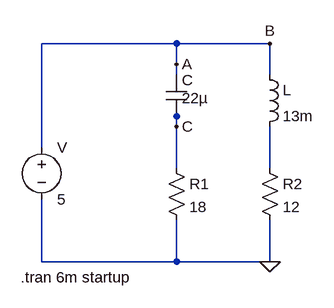
[diagram p0: schematic Carga.asc]
Carga.asc, the LTspice schematic file:
Version 4
SHEET 1 880 680
WIRE 272 0 64 0
WIRE 416 0 272 0
WIRE 272 32 272 0
WIRE 272 48 272 32
WIRE 416 48 416 0
WIRE 272 112 272 96
WIRE 272 128 272 112
WIRE 64 160 64 0
WIRE 272 192 272 128
WIRE 416 192 416 128
WIRE 64 336 64 240
WIRE 272 336 272 272
WIRE 272 336 64 336
WIRE 416 336 416 272
WIRE 416 336 272 336
FLAG 416 336 0
FLAG 416 0 B
FLAG 272 128 C
FLAG 272 32 A
SYMBOL voltage 64 144 R0
WINDOW 123 0 0 Left 0
WINDOW 39 0 0 Left 0
SYMATTR InstName V
SYMATTR Value 5
SYMBOL res 256 176 R0
SYMATTR InstName R1
SYMATTR Value 18
SYMBOL ind 400 32 R0
SYMATTR InstName L
SYMATTR Value 13m
SYMBOL res 400 176 R0
SYMATTR InstName R2
SYMATTR Value 12
SYMBOL cap 256 48 R0
WINDOW 3 24 36 Left 2
SYMATTR Value 22µ
SYMATTR InstName C
TEXT 32 360 Left 2 !.tran 6m startup

The netlist it stands for:
* Carga.asc
V A 0 5
R1 C 0 18
L A N001 13m
R2 N001 0 12
C A C 22µ
.tran 6m startup
.backanno
.end